# EAGLE design iot-enviroment-shield (EAGLE 6.5.0)
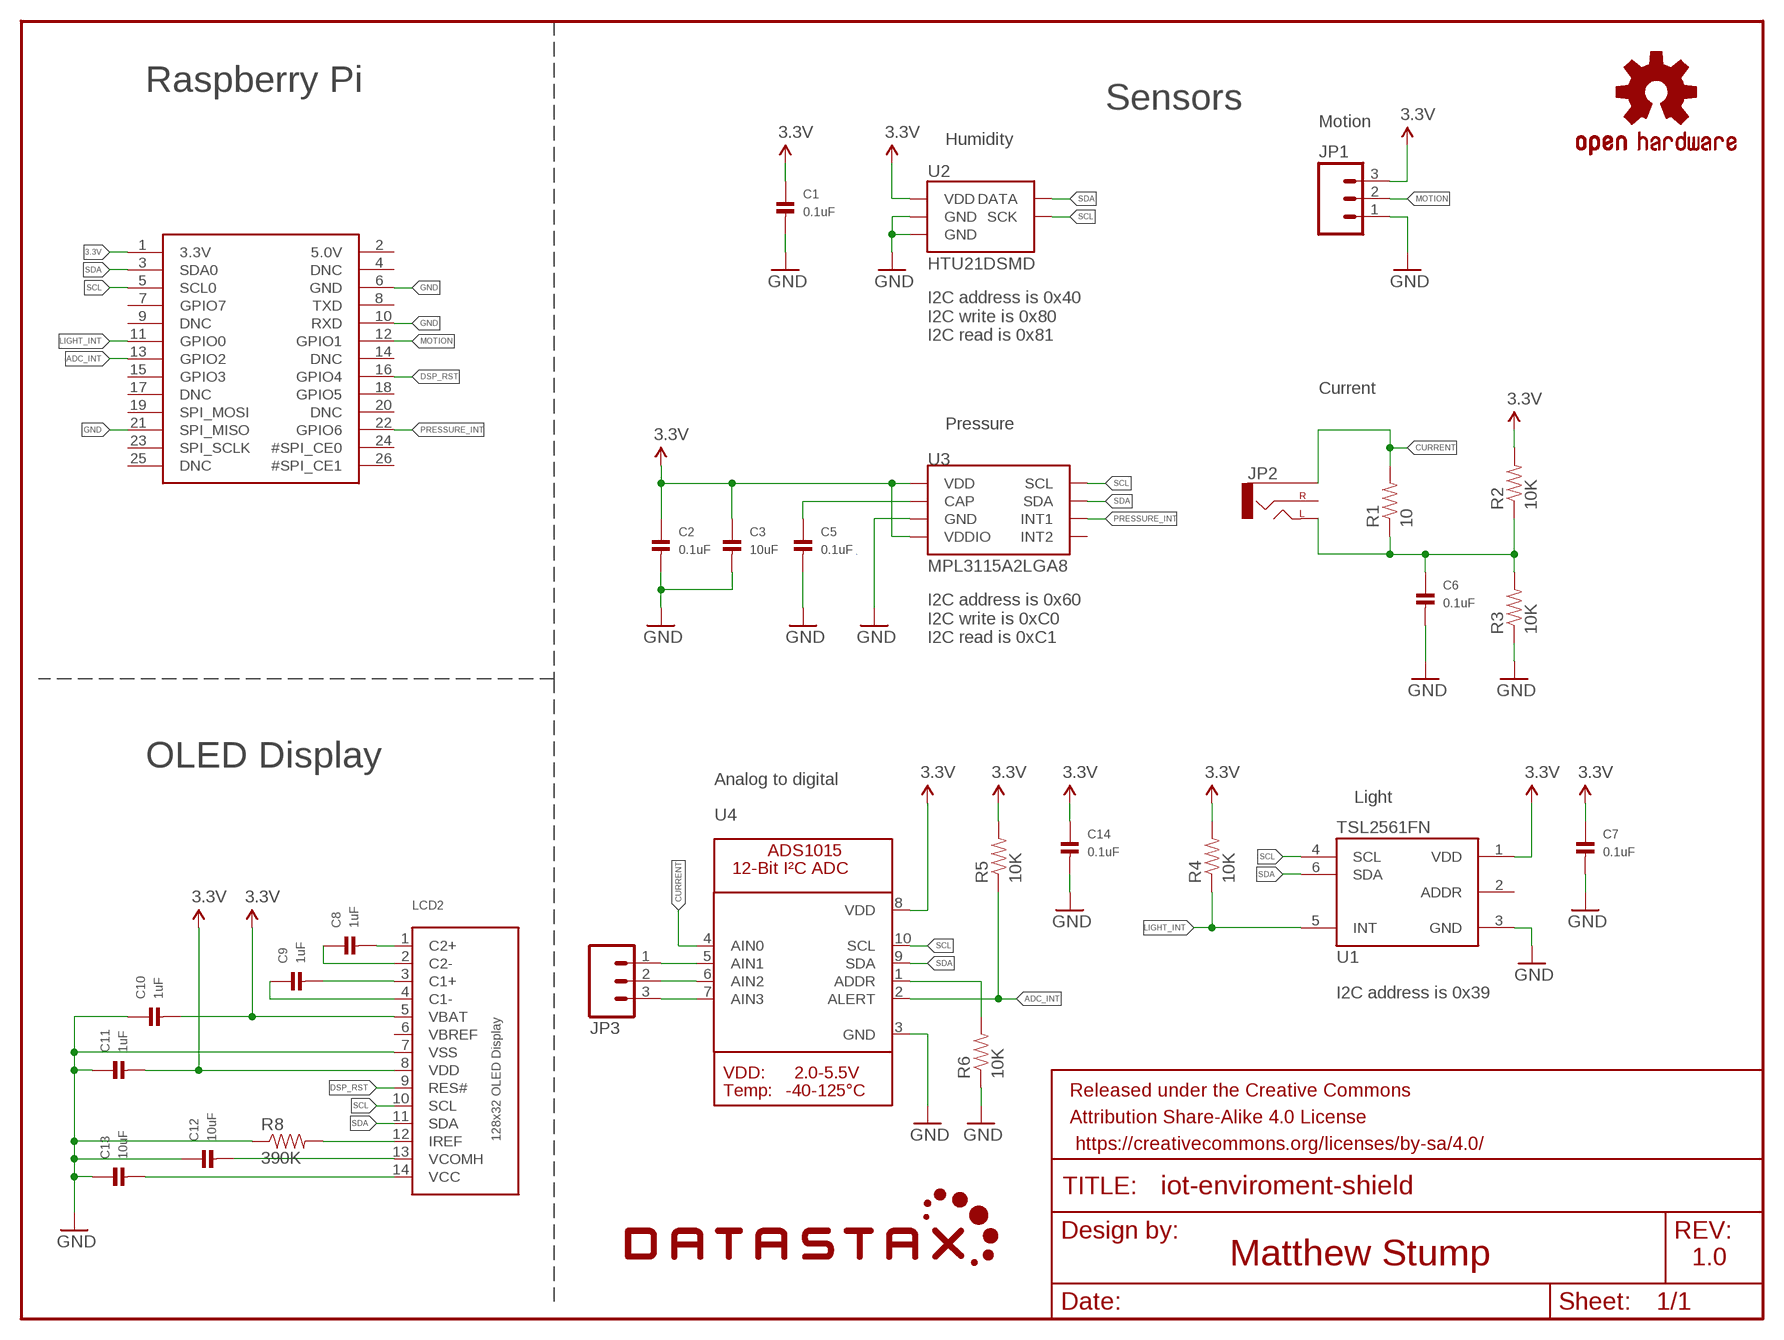
[diagram p0: schematic, sheet 1]

## Parts
C1  0.1uF  CAP_CERAMIC0603  [0603]
C2  0.1uF  CAP_CERAMIC0603  [0603]
C3  10uF  CAP_CERAMIC0603  [0603]
C5  0.1uF  CAP_CERAMIC0603  [0603]
C6  0.1uF  CAP_CERAMIC0603  [0603]
C7  0.1uF  CAP_CERAMIC0603  [0603]
C8  1uF  CAP_CERAMIC0603  [0603]
C9  1uF  CAP_CERAMIC0603  [0603]
C10  1uF  CAP_CERAMIC0603  [0603]
C11  1uF  CAP_CERAMIC0603  [0603]
C12  10uF  CAP_CERAMIC0603  [0603]
C13  10uF  CAP_CERAMIC0603  [0603]
C14  0.1uF  CAP_CERAMIC0603  [0603]
FRAME1  FRAME-LETTER  [CREATIVE_COMMONS]
JP1  M03SCREW  [SCREWTERMINAL-3.5MM-3]
JP2  AUDIO-JACKPTH  [AUDIO-JACK]
JP3  M03SCREW  [SCREWTERMINAL-3.5MM-3]
LCD2  DISP_OLED_UG-2832HSWEG02  [UG-2832HSWEG02_WRAPUNDER]
LOGO1  OSHW-LOGOL  [OSHW-LOGO-L]
R1  10  RESISTOR0603-RES  [0603-RES]
R2  10K  RESISTOR0603-RES  [0603-RES]
R3  10K  RESISTOR0603-RES  [0603-RES]
R4  10K  RESISTOR0603-RES  [0603-RES]
R5  10K  RESISTOR0603-RES  [0603-RES]
R6  10K  RESISTOR0603-RES  [0603-RES]
R8  390K  RESISTOR0603-RES  [0603-RES]
U1  TSL2561FN  [FN-6]
U2  HTU21DSMD  [HTU21D]
U3  MPL3115A2LGA8  [LGA8]
U4  ADC_ADS1015  [MSOP10]
U$1  DATASTAX_LOGO  [DATASTAX_LOGO]
U$2  RASPBERRYPI_BB  [RASBERRYPI_SHIELD]

## Nets
3.3V: C1.1 C2.1 C3.1 C7.1 C10.2 C11.2 C14.1 JP1.3 LCD2.5(VBAT) LCD2.8(VDD) R2.2 R4.2 R5.2 U1.1(VDD) U2.VDD U3.1(VDD) U3.4(VDDIO) U4.8(VDD) U$2.1(3.3V)
ADC_INT: R5.1 U4.2(ALERT) U$2.13(GPIO2)
CURRENT: JP2.SLEEVE R1.2 U4.4(AIN0)
DSP_RST: LCD2.9(RES#) U$2.16(GPIO4)
GND: C1.2 C2.2 C3.2 C5.2 C6.2 C7.2 C10.1 C11.1 C12.1 C13.1 C14.2 JP1.1 LCD2.7(VSS) R3.1 R6.1 R8.1 U1.3(GND) U2.7(GND) U2.GND U3.3(GND) U4.3(GND) U$2.6(GND) U$2.10(RXD) U$2.21(SPI_MISO)
LIGHT_INT: R4.1 U1.5(INT) U$2.11(GPIO0)
MOTION: JP1.2 U$2.12(GPIO1)
N$1: C5.1 U3.2(CAP)
N$2: JP3.1 U4.5(AIN1)
N$3: C6.1 JP2.TIP(LEFT) R1.1 R2.1 R3.2
N$4: R6.2 U4.1(ADDR)
N$5: JP3.2 U4.6(AIN2)
N$6: JP3.3 U4.7(AIN3)
N$10: C8.2 LCD2.1(C2+)
N$11: C9.2 LCD2.3(C1+)
N$12: C13.2 LCD2.14(VCC)
N$13: LCD2.12(IREF) R8.2
N$14: C8.1 LCD2.2(C2-)
N$15: C9.1 LCD2.4(C1-)
N$19: C12.2 LCD2.13(VCOMH)
PRESSURE_INT: U3.6(INT1) U$2.22(GPIO6)
SCL: LCD2.10(SCL) U1.4(SCL) U2.SCK U3.8(SCL) U4.10(SCL) U$2.5(SCL0)
SDA: LCD2.11(SDA) U1.6(SDA) U2.DATA U3.7(SDA) U4.9(SDA) U$2.3(SDA0)
Unconnected: JP2.RING(RIGHT) U1.2(ADDR) U3.5(INT2) U$2.2(5.0V) U$2.4(DNC) U$2.7(GPIO7) U$2.8(TXD) U$2.9(DNC) U$2.14(DNC) U$2.15(GPIO3) U$2.17(DNC) U$2.18(GPIO5) U$2.19(SPI_MOSI) U$2.20(DNC) U$2.23(SPI_SCLK) U$2.24(#SPI_CE0) U$2.25(DNC) U$2.26(#SPI_CE1)

## Notes on the sheet
- Raspberry Pi
- Sensors
- Motion
- Humidity
- I2C address is 0x40
  I2C write is 0x80
  I2C read is 0x81
- Current
- Pressure
- /Users/mstump/Downloads/datastax_logo_black.bmp
- I2C address is 0x60
  I2C write is 0xC0
  I2C read is 0xC1
- OLED Display
- Analog to digital
- Light
- I2C address is 0x39
- Matthew Stump | 1.0

## Power pins joined to a net without a drawn wire
VBREF: LCD2.6(VBREF)

## Library data of the parts
C1 C2 C5-C7 C14 = microbuilder:CAP_CERAMIC: Ceramic Capacitors 0402 - 0402 Surface Mount Capacitors 16pF 50V 5% [Digikey: 445-4899-2-ND] 18pF 50V 5% [Digikey: 490-1281-2-ND] 22pF 50V 5% [Digikey: 490-1283-2-ND] 68pF 50V 5% [Digikey: 490-1289-2-ND] 0.1uF 10V 10% [Digikey: 490-1318-2-ND] 1.0uF 6.3V 10% [Digikey: 490-1320-2-ND] 0603 - 0603 Surface Mount Capacitors 16 pF 50V 5% [Digikey: 445-5051-2-ND] 22 pF 50V [Digikey: PCC220ACVTR-ND] 33 pF 50V 5% [Digikey: 490-1415-1-ND] 56pF 50V 5% [Digikey: 490-1421-1-ND] 220pF 50V 5% [Digikey: 445-1285-1-ND] 680 pF 50V 2200 pF 50V 5% C0G [Digikey: 445-1297-1-ND] 5600 pF 100V 5% X7R [Digikey: 478-3711-1-ND] 0.1 µF 25V 10% [Digikey: PCC2277TR-ND] 0.22 µF 16V 10% X7R [Digikey: 445-1318-1-ND] 1.0 µF 25V 10% [Digikey: 445-5146-2-ND] 0603 - RF Specific 3pF 250V +/-0.1pF RF [Digikey: 712-1347-1-ND] 18 pF 250V 5% [Digikey: 478-3505-1-ND or 712-1322-1-ND] 56 pF 250V 5% C0G RF [Digikey: 490-4867-1-ND] 68 pF 250V RF [Digikey: 490-4868-1-ND] 0805 - 0805 Surface Mount Capacitors 220 pF 250V 2% RF Ceramic Capacitor [Digikey: 712-1398-1-ND] 1000 pF 50V 2% NP0 Ceramic Capacitor [Digikey: 478-3760-1-ND] 0.1 µF 25V 10% Ceramic Capacitor [Digikey: PCC1828TR-ND] 1.0 µF 16V 10% Ceramic Capacitor[Digikey: 490-1691-2-ND] 10.0 µF 10V 10% Ceramic Capacitor[Digikey: 709-1228-1-ND] 10.0 uF 16V 10% Ceramic Capacitor [Digikey: 478-5165-2-ND] 47 uF 6.3V 20% Ceramic Capacitor [Digikey: 587-1779-1-ND or 399-5506-1-ND] 1206 - 1206 Surface Mount Capacitors 47uF 10V 20% Ceramic Capacitor [Digikey: 490-5528-1-ND or 399-5508-1-ND or 445-6010-1-ND] 100uF 6.3V -20%, +80% Y5V Ceramic Capacitor (Digikey: 490-4512-1-ND, Mouser: 81-GRM31CF50J107ZE1L); MPN: 0603YC104JAT2A; OC_NEWARK: 96M1175
C3 C12 C13 = microbuilder:CAP_CERAMIC: Ceramic Capacitors 0402 - 0402 Surface Mount Capacitors 16pF 50V 5% [Digikey: 445-4899-2-ND] 18pF 50V 5% [Digikey: 490-1281-2-ND] 22pF 50V 5% [Digikey: 490-1283-2-ND] 68pF 50V 5% [Digikey: 490-1289-2-ND] 0.1uF 10V 10% [Digikey: 490-1318-2-ND] 1.0uF 6.3V 10% [Digikey: 490-1320-2-ND] 0603 - 0603 Surface Mount Capacitors 16 pF 50V 5% [Digikey: 445-5051-2-ND] 22 pF 50V [Digikey: PCC220ACVTR-ND] 33 pF 50V 5% [Digikey: 490-1415-1-ND] 56pF 50V 5% [Digikey: 490-1421-1-ND] 220pF 50V 5% [Digikey: 445-1285-1-ND] 680 pF 50V 2200 pF 50V 5% C0G [Digikey: 445-1297-1-ND] 5600 pF 100V 5% X7R [Digikey: 478-3711-1-ND] 0.1 µF 25V 10% [Digikey: PCC2277TR-ND] 0.22 µF 16V 10% X7R [Digikey: 445-1318-1-ND] 1.0 µF 25V 10% [Digikey: 445-5146-2-ND] 0603 - RF Specific 3pF 250V +/-0.1pF RF [Digikey: 712-1347-1-ND] 18 pF 250V 5% [Digikey: 478-3505-1-ND or 712-1322-1-ND] 56 pF 250V 5% C0G RF [Digikey: 490-4867-1-ND] 68 pF 250V RF [Digikey: 490-4868-1-ND] 0805 - 0805 Surface Mount Capacitors 220 pF 250V 2% RF Ceramic Capacitor [Digikey: 712-1398-1-ND] 1000 pF 50V 2% NP0 Ceramic Capacitor [Digikey: 478-3760-1-ND] 0.1 µF 25V 10% Ceramic Capacitor [Digikey: PCC1828TR-ND] 1.0 µF 16V 10% Ceramic Capacitor[Digikey: 490-1691-2-ND] 10.0 µF 10V 10% Ceramic Capacitor[Digikey: 709-1228-1-ND] 10.0 uF 16V 10% Ceramic Capacitor [Digikey: 478-5165-2-ND] 47 uF 6.3V 20% Ceramic Capacitor [Digikey: 587-1779-1-ND or 399-5506-1-ND] 1206 - 1206 Surface Mount Capacitors 47uF 10V 20% Ceramic Capacitor [Digikey: 490-5528-1-ND or 399-5508-1-ND or 445-6010-1-ND] 100uF 6.3V -20%, +80% Y5V Ceramic Capacitor (Digikey: 490-4512-1-ND, Mouser: 81-GRM31CF50J107ZE1L); MPN: 06035A100FAT2A; OC_NEWARK: 43T7237
C8-C11 = microbuilder:CAP_CERAMIC: Ceramic Capacitors 0402 - 0402 Surface Mount Capacitors 16pF 50V 5% [Digikey: 445-4899-2-ND] 18pF 50V 5% [Digikey: 490-1281-2-ND] 22pF 50V 5% [Digikey: 490-1283-2-ND] 68pF 50V 5% [Digikey: 490-1289-2-ND] 0.1uF 10V 10% [Digikey: 490-1318-2-ND] 1.0uF 6.3V 10% [Digikey: 490-1320-2-ND] 0603 - 0603 Surface Mount Capacitors 16 pF 50V 5% [Digikey: 445-5051-2-ND] 22 pF 50V [Digikey: PCC220ACVTR-ND] 33 pF 50V 5% [Digikey: 490-1415-1-ND] 56pF 50V 5% [Digikey: 490-1421-1-ND] 220pF 50V 5% [Digikey: 445-1285-1-ND] 680 pF 50V 2200 pF 50V 5% C0G [Digikey: 445-1297-1-ND] 5600 pF 100V 5% X7R [Digikey: 478-3711-1-ND] 0.1 µF 25V 10% [Digikey: PCC2277TR-ND] 0.22 µF 16V 10% X7R [Digikey: 445-1318-1-ND] 1.0 µF 25V 10% [Digikey: 445-5146-2-ND] 0603 - RF Specific 3pF 250V +/-0.1pF RF [Digikey: 712-1347-1-ND] 18 pF 250V 5% [Digikey: 478-3505-1-ND or 712-1322-1-ND] 56 pF 250V 5% C0G RF [Digikey: 490-4867-1-ND] 68 pF 250V RF [Digikey: 490-4868-1-ND] 0805 - 0805 Surface Mount Capacitors 220 pF 250V 2% RF Ceramic Capacitor [Digikey: 712-1398-1-ND] 1000 pF 50V 2% NP0 Ceramic Capacitor [Digikey: 478-3760-1-ND] 0.1 µF 25V 10% Ceramic Capacitor [Digikey: PCC1828TR-ND] 1.0 µF 16V 10% Ceramic Capacitor[Digikey: 490-1691-2-ND] 10.0 µF 10V 10% Ceramic Capacitor[Digikey: 709-1228-1-ND] 10.0 uF 16V 10% Ceramic Capacitor [Digikey: 478-5165-2-ND] 47 uF 6.3V 20% Ceramic Capacitor [Digikey: 587-1779-1-ND or 399-5506-1-ND] 1206 - 1206 Surface Mount Capacitors 47uF 10V 20% Ceramic Capacitor [Digikey: 490-5528-1-ND or 399-5508-1-ND or 445-6010-1-ND] 100uF 6.3V -20%, +80% Y5V Ceramic Capacitor (Digikey: 490-4512-1-ND, Mouser: 81-GRM31CF50J107ZE1L); MF: AVX CORPORATION; MPN: 06036D105KAT2A; OC_NEWARK: 84K8390
FRAME1 = SparkFun-Aesthetics:FRAME-LETTER: Schematic Frame Standard 8.5x11 US Letter frame; OC_NEWARK: unknown
JP1 JP3 = SparkFun-Connectors:M03: Header 3 Standard 3-pin 0.1" header. Use with straight break away headers (SKU : PRT-00116), right angle break away headers (PRT-00553), swiss pins (PRT-00743), machine pins (PRT-00117), and female headers (PRT-00115). Molex polarized connector foot print use with SKU : PRT-08232 with associated crimp pins and housings.; MF: WEIDMULLER, INC.; MPN: 1699680000; OC_NEWARK: 17M8360
JP2 = SparkFun-Connectors:AUDIO-JACK: 3.5mm Audio Jack Simple 3.5mm common PCB mount audio jack. SKU: PRT-08032; OC_NEWARK: unknown
LCD2 = microbuilder:DISP_OLED_UG-2832HSWEG02: 128x32 I2C 0.91" Monochrome OLED Display; OC_NEWARK: unknown
LOGO1 = SparkFun-Aesthetics:OSHW-LOGO: Open Source Hardware Logo This logo indicates the piece of hardware it is found on incorporates a OSHW license and/or adheres to the definition of open source hardware found here: http://freedomdefined.org/OSHW; OC_NEWARK: unknown
R1 = SparkFun-Passives:RESISTOR: Resistor Basic schematic elements and footprints for 0603, 1206, and PTH resistors.; MPN: ERJ-3EKF10R0V; OC_NEWARK: 64R5306
R2-R6 = SparkFun-Passives:RESISTOR: Resistor Basic schematic elements and footprints for 0603, 1206, and PTH resistors.; MPN: ERJ-P03F1002V; OC_NEWARK: 32R9341
R8 = SparkFun-Passives:RESISTOR: Resistor Basic schematic elements and footprints for 0603, 1206, and PTH resistors.; MPN: ERJ-P03F3903V; OC_NEWARK: 32R9378
U1 = mike-temp:TSL2561: TSL2561 illumination sensor Approximates Human Eye Response Precisely Measures Illuminance Programmable Interrupt Function with User-Defined Upper and Lower Threshold 400 KHz I2C interface Programmable Analog Gain and Integration Time Supporting 1,000,000-to-1 Dynamic Range Automatically Rejects 50/60-Hz Lighting Ripple Low Active Power (0.75 mW Typical) with Power Down Mode RoHS Compliant The TSL2561 is a light-to-digital converter that transform light intensity to a digital signal output via I2C interface. The device combines one broadband photodiode (visible plus infrared) and one infrared-responding photodiode on a single CMOS integrated circuit capable of providing a near-photopic response over an effective 20-bit dynamic range (16-bit resolution). Two integrating ADCs convert the photodiode currents to a digital output that represents the irradiance measured on each channel. This digital output can be input to a microprocessor where illuminance (ambient light level) in lux is derived using an empirical formula to approximate the human eye response. The TSL2561 device supports a traditional level style interrupt that remains asserted until the firmware clears it.; MPN: TSL2561T; OC_NEWARK: 05M1632
U2 = SparkFun-Sensors:HTU21D; MPN: HTU21D; OC_NEWARK: 37X5938
U3 = SparkFun-Sensors:MPL3115A2: Altimeter/Pressure Sensor, I2C, 1.95V-3.6V supply, 50 to 110kPa; MPN: MPL3115A2; OC_NEWARK: 48T4344
U4 = microbuilder:ADC_ADS1015: ADS1015 - 12-bit 4-Channel I2C ADC with Internal PGA VDD: 2.0-5.5V Sampling Rate: 3.3ksps Gain Settings: 2/3, 1, 2, 4, 8, 16 I2C Address: ADDR low = 1001000x, ADDR high = 1001001x Internal Comparator The ADS1015 includes an internal comparator that can be set to output a high-level on ALERT when the conversion results exceeeds a pre-defined upper level, and will deassert itself when the level falls below a pre-defined lower threshold level. It can also be set to windowed mode where the ALERT pin will be asserted if the data exceeds the upper threshold or falls below the lower threshold.; MPN: ADS1015IDGST; OC_NEWARK: 35R0211
U$1 = datastax:DATASTAX_LOGO
U$2 = microbuilder:RASPBERRYPI_B; OC_NEWARK: unknown

## Board
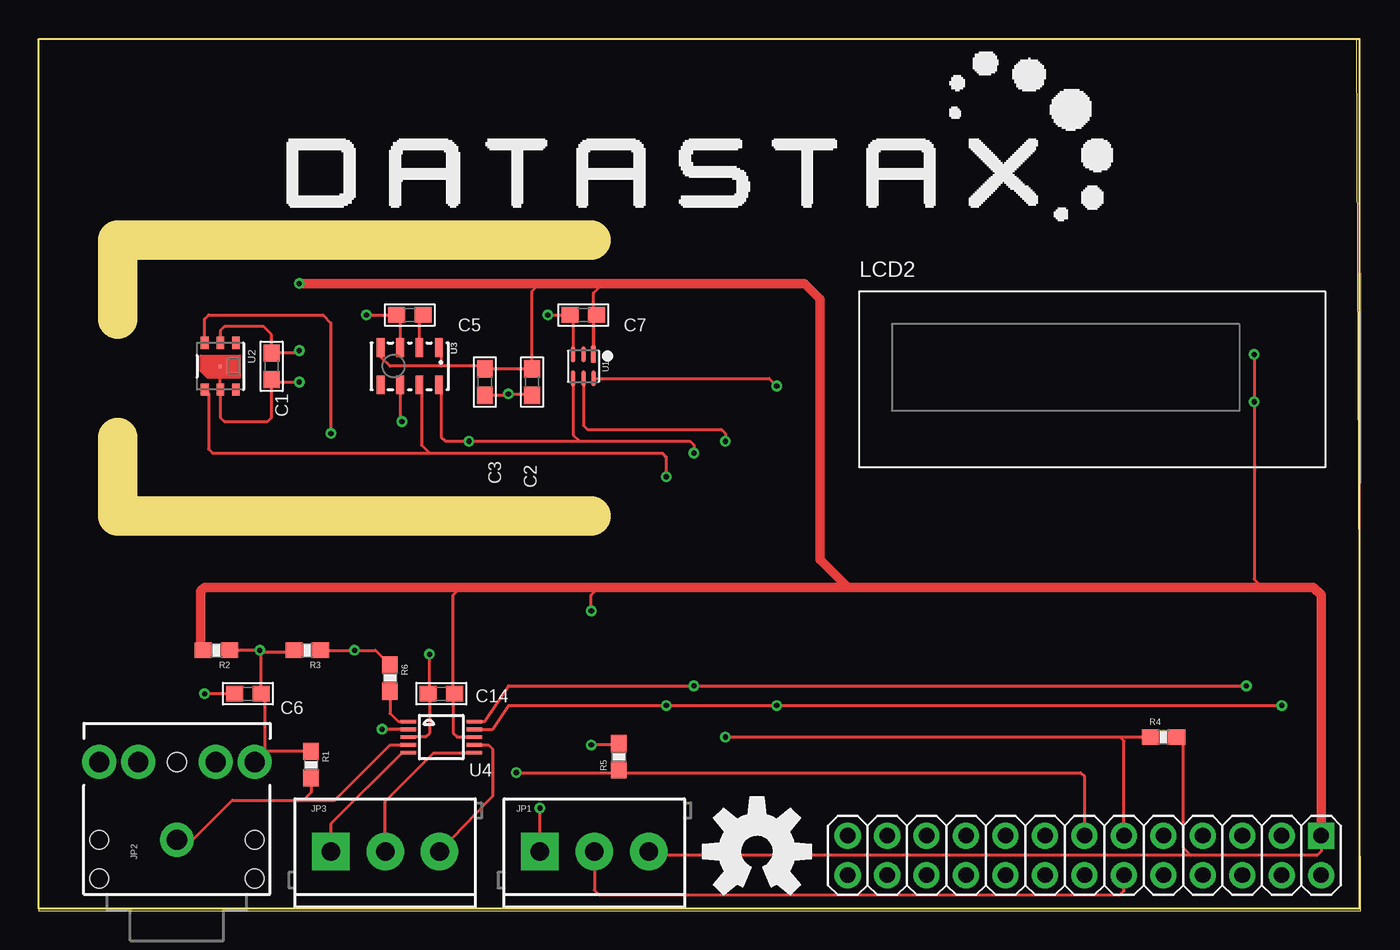
[diagram p1: board, top side]
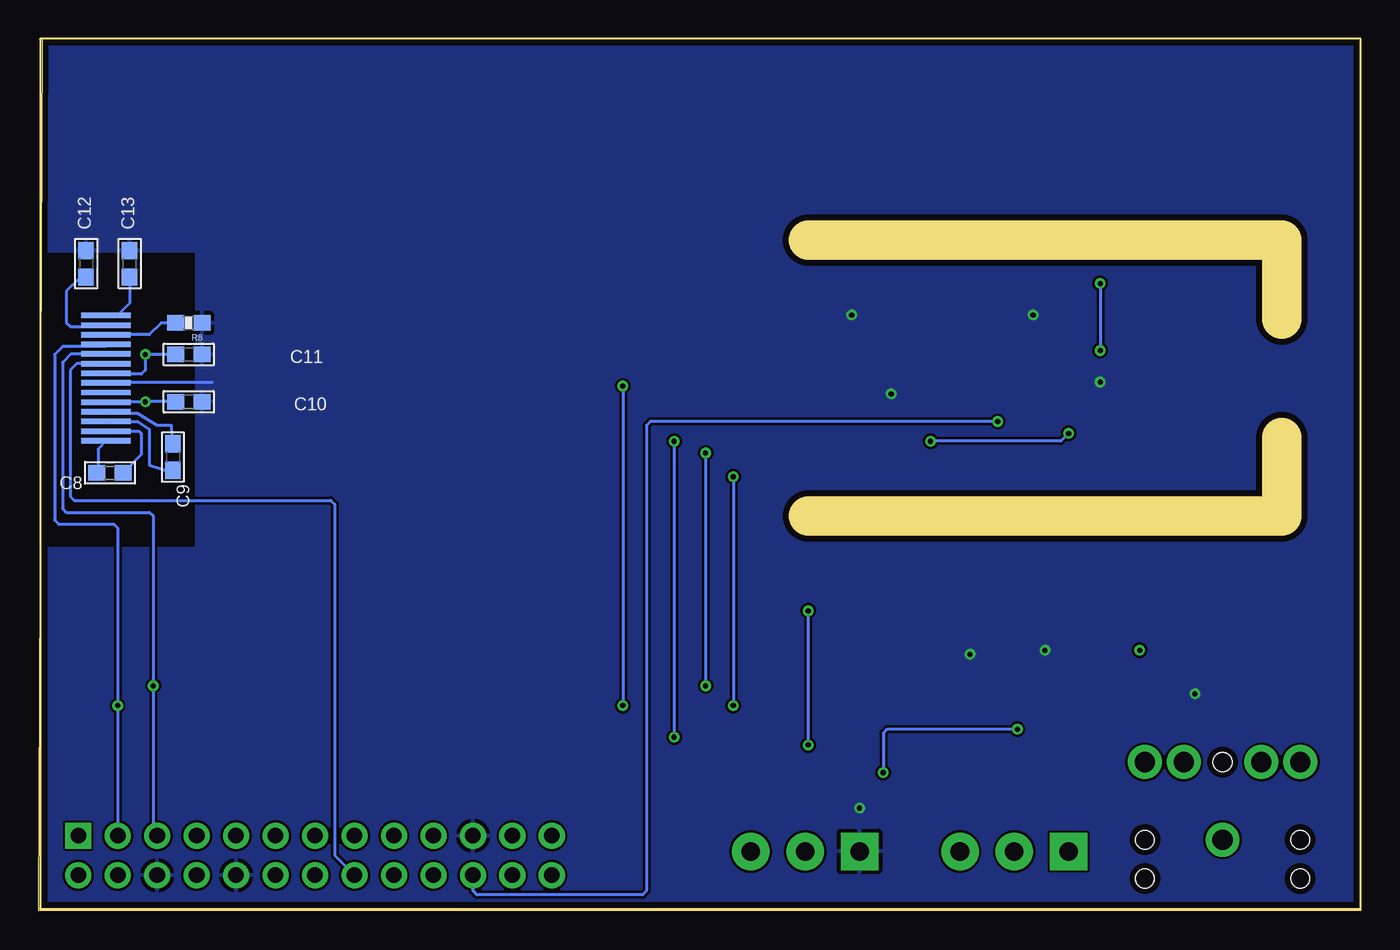
[diagram p2: board, bottom side, seen from below]

Size 85.09 x 56.13 mm. Coordinates in mm from the lower left corner, seen from the top.
Outline: 35.56,43.18 5.08,43.18 5.08,38.1
Outline: 35.56,25.4 5.08,25.4 5.08,30.48
Outline: 0,0 85.09,0 84.84,56.13 0,56.13 0,0
Copper layers (1*16): Top 0.0356mm / dielectric 1.5011mm / Bottom 0.0356mm
Design rules "LaenPCBOrder": minimum track width 6mil, minimum drill 13mil, track to track 6mil, track to pad 6mil, pad to pad 6mil, via to via 6mil, smd to smd 6mil, copper to edge 15mil, drill to drill 6mil, minimum pad ring 7mil, minimum via ring 7mil, stop-mask expansion 3mil, vias tented up to drill 0mil, thermal gap 10mil

### Footprints (pad centres in the part's own frame; a part is rotated, then mirrored left to right if it is on the bottom)
0603 = smd 1.1 x 1: 1 -0.85,0; 2 0.85,0
SCREWTERMINAL-3.5MM-3 = drill 1.2 pad 2.413 square: 1 0,0 | drill 1.2 pad 2.413: 2 3.5,0; 3 7,0
AUDIO-JACK = drill 1.3 pad 2.184: RING 5,5; RSH 5,2.5; SLEEVE 0,0; TIP 5,-5; TSH 5,-2.5 | hole 1.2: 0,5; -2.5,5; -2.5,-5; 0,-5; 5,0
UG-2832HSWEG02_WRAPUNDER = smd 3.2 x 0.35 bottom: 1 -2.03,-4.03; 2 -2.03,-3.41; 3 -2.03,-2.79; 4 -2.03,-2.17; 5 -2.03,-1.55; 6 -2.03,-0.93; 7 -2.03,-0.31; 8 -2.03,0.31; 9 -2.03,0.93; 10 -2.03,1.55; 11 -2.03,2.17; 12 -2.03,2.79; 13 -2.03,3.41; 14 -2.03,4.03
0603-RES = smd 1.1 x 1: 1 -0.85,0; 2 0.85,0
FN-6 = smd 1.05 x 0.3: 1 -0.775,0.65; 2 -0.775,0; 3 -0.775,-0.65; 4 0.775,-0.65; 5 0.775,0; 6 0.775,0.65
HTU21D = smd 0.2 x 0.2: 7 0,0 | smd 0.8 x 0.5: DATA 1.5,-1; GND 1.5,0; NC@1 -1.5,1; NC@6 1.5,1; SCK -1.5,-1; VDD -1.5,0
LGA8 = smd 1.2 x 0.5: 1 -1.2,1.875; 2 -1.2,0.625; 3 -1.2,-0.625; 4 -1.2,-1.875; 5 1.2,-1.875; 6 1.2,-0.625; 7 1.2,0.625; 8 1.2,1.875
MSOP10 = smd 0.25 x 1: 1 -1,-2.113; 2 -0.5,-2.113; 3 0,-2.113; 4 0.5,-2.113; 5 1,-2.113; 6 1,2.113; 7 0.5,2.113; 8 0,2.113; 9 -0.5,2.113; 10 -1,2.113
RASBERRYPI_SHIELD = drill 1 pad 1.676 square: 1 51.308,82.55 | drill 1 pad 1.676: 2 53.848,82.55; 3 51.308,80.01; 4 53.848,80.01; 5 51.308,77.47; 6 53.848,77.47; 7 51.308,74.93; 8 53.848,74.93; 9 51.308,72.39; 10 53.848,72.39; 11 51.308,69.85; 12 53.848,69.85; 13 51.308,67.31; 14 53.848,67.31; 15 51.308,64.77; 16 53.848,64.77; 17 51.308,62.23; 18 53.848,62.23; 19 51.308,59.69; 20 53.848,59.69; 21 51.308,57.15; 22 53.848,57.15; 23 51.308,54.61; 24 53.848,54.61; 25 51.308,52.07; 26 53.848,52.07

### Placement (x,y rotation side)
C1  14.99,35.05 270 top
C2  31.75,34.04 270 top
C3  28.7,34.04 270 top
C5  23.88,38.35 180 top
C6  13.46,13.97 180 top
C7  35.05,38.35 180 top
C8  80.52,28.19 180 bottom
C9  76.45,29.21 270 bottom
C10  75.44,32.77 180 bottom
C11  75.44,35.81 180 bottom
C12  82.04,41.66 270 bottom
C13  79.25,41.66 270 bottom
C14  25.91,13.97 180 top
FRAME1  10.16,-18.03 0 top  (outside the outline)
JP1  32.26,3.81 0 top
JP2  8.89,4.57 90 top
JP3  18.8,3.81 0 top
LCD2  82.8,34.29 0 top
LOGO1  46.23,3.81 0 top
R1  17.53,9.4 270 top
R2  11.43,16.76 180 top
R3  17.27,16.76 180 top
R4  72.39,11.18 0 top
R5  37.34,9.91 90 top
R6  22.61,14.99 270 top
R8  75.44,37.85 180 bottom
U1  35.05,35.05 270 top
U2  11.68,35.05 270 top
U3  23.88,35.05 270 top
U4  25.91,11.18 270 top
U$1  16,44.45 0 top
U$2  0,56.13 270 top

### Tracks (layer width: path | path; a pad name or v marks a point on that pad's centre or on a via)
3.3V  (via drill 0.33)
  Top 0.203: U2.VDD 11.68,37.34 11.94,37.59 14.48,37.59 14.99,37.08 C1.1 16.6,35.9 v16.76,36.07 | 25.91,35.05 28.61,35.05 C3.1 C2.1 31.75,39.88 32.26,40.39 32.51,40.39 | 25.91,35.05 22.61,35.05 22,35.66 U3.4 | U3.1 25.91,36.09 25.91,35.05 | C7.1 35.7,38.15 U1.1 35.7,39.77 36.32,40.39 | U4.8 26.92,11.18 26.67,11.43 26.67,13.97 | R2.2 10.41,16.76 | U$2.1 82.55,3.81 82.3,3.56 74.17,3.56 | 74.17,3.56 39.51,3.56 JP1.3 | R4.2 73.66,10.92 73.66,4.06 74.17,3.56 | R5.2 37.25,10.67 v35.56,10.67 | v35.56,19.3 35.56,20.32 35.81,20.57 35.81,20.83 | 26.67,14.14 26.67,20.32 27.18,20.83 | 26.67,14.14 C14.1 26.67,13.97 | 26.67,14.14 26.67,13.97 | v78.23,35.81 v78.23,32.77 78.23,21.34 78.49,21.08 78.49,20.83
  Top 0.61: U$2.1 82.55,20.32 82.04,20.83 78.49,20.83 52.07,20.83 | 52.07,20.83 35.81,20.83 27.18,20.83 10.67,20.83 10.41,20.57 10.41,16.76 | 52.07,20.83 50.29,22.61 50.29,39.37 49.28,40.39 36.32,40.39 32.51,40.39 v16.76,40.39
  Bottom 0.203: v16.76,40.39 v16.76,36.07 | v35.56,10.67 v35.56,19.3 | LCD2.5 80.75,32.77 v78.23,32.77 C10.2 | C11.2 v78.23,35.81 78.23,34.8 78.49,34.54 80.72,34.54 LCD2.8
ADC_INT  (via drill 0.33)
  Top 0.203: v30.73,8.89 37.17,8.89 R5.1 37.5,8.89 67.06,8.89 67.31,8.64 U$2.13 | U4.2 v22.11,11.68 v22.1,11.68
  Bottom 0.203: v22.1,11.68 30.48,11.68 30.73,11.43 v30.73,8.89
CURRENT
  Top 0.203: JP2.SLEEVE 9.91,4.57 12.45,7.11 17.02,7.11 | 17.02,7.11 19.05,7.11 22.61,10.67 23.79,10.67 U4.4 | R1.2 17.53,7.62 17.02,7.11
DSP_RST
  Bottom 0.203: LCD2.9 82.64,35.22 83.06,34.8 83.06,26.67 82.8,26.42 66.29,26.42 66.04,26.16 66.04,24.13 66.04,23.37 66.04,3.56 U$2.16
GND  (via drill 0.33)
  Top 0.203: U2.7 U2.GND 11.68,31.75 11.94,31.5 14.73,31.5 14.99,31.75 C1.2 15.07,34.2 15.24,34.04 v16.76,34.04 | C7.2 34.4,38.15 U1.3 | U4.3 24.89,11.18 25.15,11.43 25.15,13.97 25.06,14.06 C14.2 25.15,14.31 v25.15,16.51 | R3.1 v20.32,16.76 21.68,16.76 R6.1 | C3.2 30.14,33.19 v30.23,33.27 31.66,33.27 C2.2 | C5.2 23.25,37.88 U3.3 | 21.15,38.35 v21.08,38.35 C5.2 | C6.2 v10.67,13.97 | v32.77,38.35 C7.2 | 34.29,38.35 C7.2 | 23.11,38.35 C5.2 | JP1.1 v32.26,6.6
  Bottom 0.203: LCD2.7 80.72,34.04 73.91,34.04
  pour Bottom: 0,56.13 0,0 85.09,0 85.09,23.37 74.93,23.37 74.93,42.42 85.09,42.42 85.09,56.13
LIGHT_INT  (via drill 0.33)
  Top 0.203: U1.5 35.05,31.24 35.31,30.99 43.94,30.99 44.2,30.73 v44.2,30.23 | v44.2,11.18 69.6,11.18 | 69.6,11.18 R4.1 | U$2.11 69.85,10.92 69.6,11.18
  Bottom 0.203: v44.2,30.23 v44.2,11.18
MOTION
  Top 0.203: JP1.2 35.76,1.33 36.07,1.02 69.6,1.02 69.85,1.27 U$2.12
N$1
  Top 0.203: 24.5,38.38 C5.1 24.5,38.33 U3.2
N$2
  Top 0.203: U4.5 23.38,10.18 18.8,5.59 JP3.1
N$3  (via drill 0.33)
  Top 0.203: R1.1 14.57,10.25 | 14.57,10.25 JP2.TIP | 14.57,10.25 14.57,13.72 C6.1 14.31,16.68 | 14.31,16.68 v14.22,16.76 R2.1 | 14.31,16.68 16.33,16.68 R3.2
N$4
  Top 0.203: R6.2 22.61,12.7 23.11,12.19 23.78,12.19 U4.1
N$5
  Top 0.203: JP3.2 22.3,7.06 25.4,10.16 28,10.16 U4.6
N$6
  Top 0.203: U4.7 28.95,10.68 29.21,10.41 29.21,7.37 28.96,7.11 JP3.3
N$10
  Bottom 0.203: LCD2.1 80.77,30.22 81.28,29.72 81.28,28.28 C8.2
N$11
  Bottom 0.203: LCD2.3 78.74,31.5 77.98,30.99 77.98,28.7 76.37,28.19 C9.2
N$12
  Bottom 0.203: C13.2 79.25,39.12 80.01,38.35 80.74,38.35 LCD2.14
N$13
  Bottom 0.203: R8.2 77.22,37.85 77.98,37.08 LCD2.12
N$14
  Bottom 0.203: LCD2.2 78.63,30.88 78.49,30.73 78.49,29.38 C8.1
N$15
  Bottom 0.203: C9.1 76.54,31.08 76.54,31.24 77.47,31.24 78.74,32 80.66,32 LCD2.4
N$19
  Bottom 0.203: C12.2 82.38,40.81 83.31,39.88 83.31,37.85 83.06,37.59 80.88,37.59 LCD2.13
PRESSURE_INT  (via drill 0.33)
  Top 0.203: U3.6 23.25,31.61 v23.37,31.5
  Bottom 0.203: v23.37,31.5 45.72,31.5 45.97,31.24 45.97,1.27 46.23,1.02 56.9,1.02 57.15,1.27 U$2.22
SCL  (via drill 0.33)
  Top 0.203: U4.10 28.69,12.18 30.23,14.48 v42.16,14.48 v77.72,14.48 | U3.8 25.91,33.7 25.91,30.48 26.16,30.23 v27.69,30.23 34.8,30.23 | 34.8,30.23 41.91,30.23 42.16,29.97 v42.16,29.46 | U1.4 34.4,30.62 34.8,30.23 | U2.SCK 10.67,36.58 10.67,38.1 10.92,38.35 18.29,38.35 18.8,37.85 v18.8,30.73
  Bottom 0.203: U$2.5 77.72,5.08 v77.72,14.48 77.72,25.4 77.98,25.65 83.31,25.65 83.57,25.91 83.57,35.31 83.03,35.84 LCD2.10 81.25,35.84 81.28,35.81 | v18.8,30.73 19.3,30.23 v27.69,30.23 | v42.16,29.46 v42.16,14.48
SDA  (via drill 0.33)
  Top 0.203: U4.9 29.2,11.68 30.23,13.21 v40.39,13.21 v47.5,13.21 v80.01,13.21 | U2.DATA 10.92,33.31 10.92,29.72 11.18,29.46 25.15,29.46 | 25.15,29.46 40.13,29.46 40.39,29.21 v40.39,27.94 | U3.7 24.64,33.72 24.64,29.97 25.15,29.46 | U1.6 47,34.28 v47.5,33.78
  Bottom 0.203: LCD2.11 80.77,36.32 | 80.77,36.32 | 80.77,36.32 83.56,36.32 84.07,35.81 84.07,25.15 83.82,24.89 80.26,24.89 80.01,24.64 v80.01,13.21 U$2.3 | v40.39,27.94 v40.39,13.21 | v47.5,33.78 v47.5,13.21

### Text on the board
Dimension: SLOT/CUTOUT | SLOT/CUTOUT